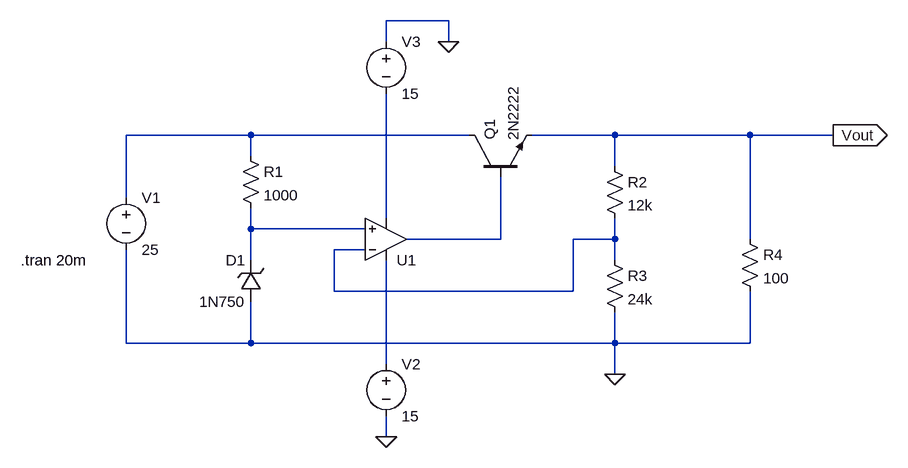
[diagram p0: schematic series-voltage_regulator.asc]
series-voltage_regulator.asc, the LTspice schematic file:
Version 4
SHEET 1 1312 680
WIRE 608 -144 512 -144
WIRE 512 -112 512 -144
WIRE 608 -112 608 -144
WIRE 304 32 112 32
WIRE 640 32 304 32
WIRE 864 32 736 32
WIRE 1072 32 864 32
WIRE 1200 32 1072 32
WIRE 304 64 304 32
WIRE 864 80 864 32
WIRE 112 128 112 32
WIRE 512 160 512 -32
WIRE 304 176 304 144
WIRE 480 176 304 176
WIRE 688 192 688 96
WIRE 688 192 544 192
WIRE 864 192 864 160
WIRE 864 192 800 192
WIRE 1072 192 1072 32
WIRE 480 208 432 208
WIRE 304 224 304 176
WIRE 864 224 864 192
WIRE 432 272 432 208
WIRE 800 272 800 192
WIRE 800 272 432 272
WIRE 112 352 112 208
WIRE 304 352 304 288
WIRE 304 352 112 352
WIRE 864 352 864 304
WIRE 864 352 304 352
WIRE 1072 352 1072 272
WIRE 1072 352 864 352
WIRE 512 384 512 224
WIRE 864 400 864 352
WIRE 512 496 512 464
FLAG 1200 32 Vout
IOPIN 1200 32 Out
FLAG 512 496 0
FLAG 608 -112 0
FLAG 864 400 0
SYMBOL voltage 112 112 R0
WINDOW 123 0 0 Left 0
WINDOW 39 0 0 Left 0
SYMATTR InstName V1
SYMATTR Value 25
SYMBOL res 288 48 R0
SYMATTR InstName R1
SYMATTR Value 1000
SYMBOL zener 320 288 R180
WINDOW 0 24 64 Left 2
WINDOW 3 24 0 Left 2
SYMATTR InstName D1
SYMATTR Value 1N750
SYMBOL OpAmps\\UniversalOpamp2 512 192 M180
SYMATTR InstName U1
SYMBOL npn 640 96 R270
SYMATTR InstName Q1
SYMATTR Value 2N2222
SYMBOL res 848 64 R0
SYMATTR InstName R2
SYMATTR Value 12k
SYMBOL res 848 208 R0
SYMATTR InstName R3
SYMATTR Value 24k
SYMBOL res 1056 176 R0
SYMATTR InstName R4
SYMATTR Value 100
SYMBOL voltage 512 368 R0
WINDOW 123 0 0 Left 0
WINDOW 39 0 0 Left 0
SYMATTR InstName V2
SYMATTR Value 15
SYMBOL voltage 512 -128 R0
WINDOW 123 0 0 Left 0
WINDOW 39 0 0 Left 0
SYMATTR InstName V3
SYMATTR Value 15
TEXT -50 224 Left 2 !.tran 20m

The netlist it stands for:
* series-voltage_regulator.asc
V1 N001 0 25
R1 N001 N003 1000
D1 0 N003 1N750
XU1 N003 N005 N006 N002 N004 level.2 Avol=1Meg GBW=10Meg Slew=10Meg ilimit=25m rail=0 Vos=0 phimargin=45 en=0 enk=0 in=0 ink=0 Rin=500Meg  ; pins IN+ IN- V+ V- OUT
Q1 N001 N004 Vout 0 2N2222
R2 Vout N005 12k
R3 N005 0 24k
R4 Vout 0 100
V2 N006 0 15
V3 0 N002 15
.model D D
.lib standard.dio
.model NPN NPN
.model PNP PNP
.lib standard.bjt
.tran 20m
.lib UniversalOpamps2.sub
.backanno
.end